# EAGLE design CCM_0020_receiver (EAGLE 9.3.2)

## Sheet 1 of 2: receiver
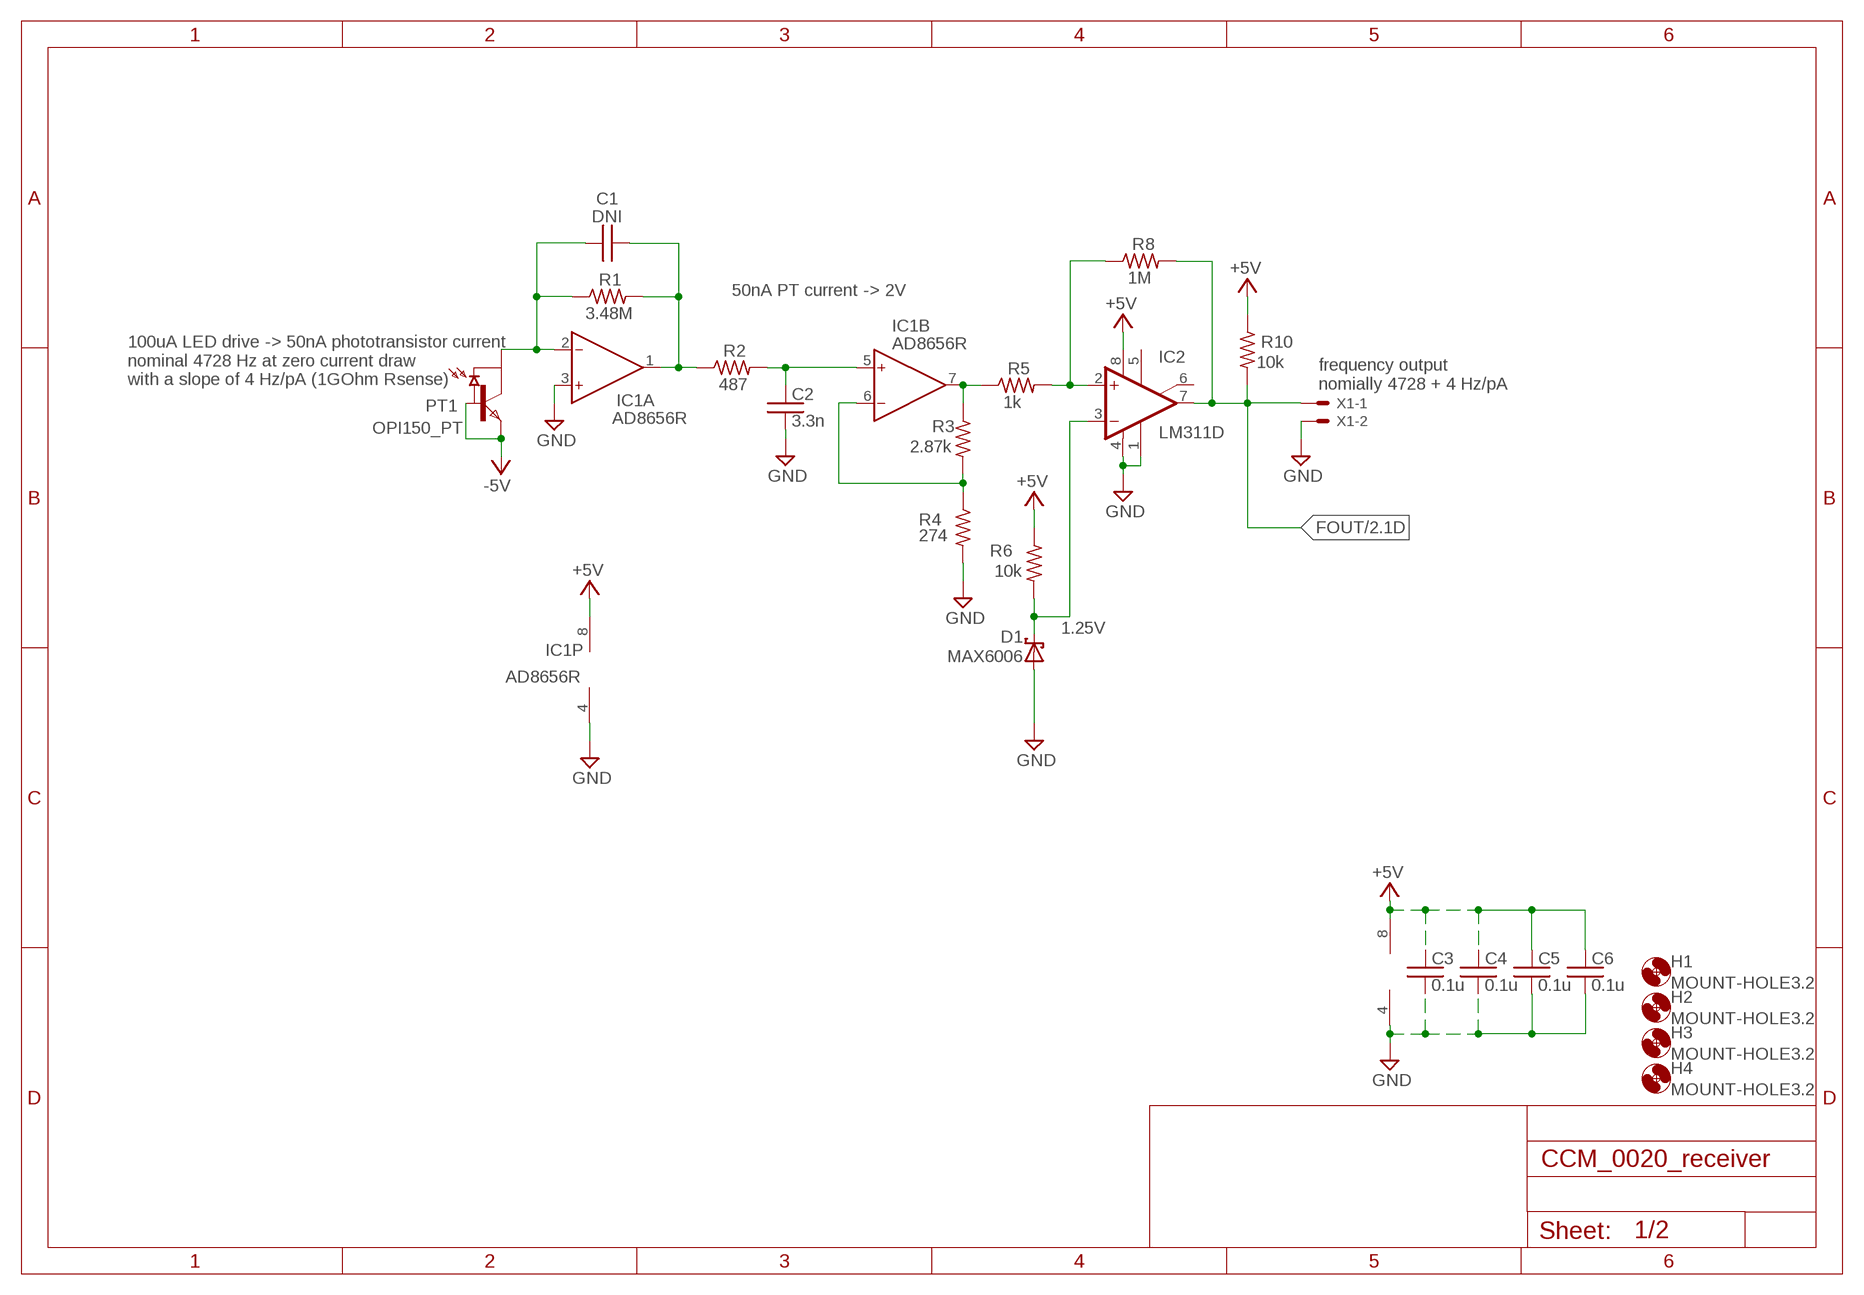
[diagram p0: schematic, sheet 1]

### Parts
C1  DNI  C0603  [0603]
C2  3.3n  C0603  [0603]
C3  0.1u  C0603  [0603]
C4  0.1u  C0603  [0603]
C5  0.1u  C0603  [0603]
C6  0.1u  C0603  [0603]
D1  MAX6006  LM4040  [SOT23]
H1  MOUNT-HOLE3.2  [3,2]
H2  MOUNT-HOLE3.2  [3,2]
H3  MOUNT-HOLE3.2  [3,2]
H4  MOUNT-HOLE3.2  [3,2]
IC1  AD8656R  [SO8]
IC2  LM311D  [SO08]
IC3  LT1495  LM393D  [SO08]
PT1  OPI150_PT  OPI150_PHOTOTRANSISTOR  [OPI150_PHOTOTRANSISTOR]
R1  3.48M  R0603  [0603]
R2  487  R0603  [0603]
R3  2.87k  R0603  [0603]
R4  274  R0603  [0603]
R5  1k  R0603  [0603]
R6  10k  R0603  [0603]
R8  1M  R0603  [0603]
R10  10k  R0603  [0603]
X1  22-23-2021  [22-23-2021]

### Nets
+5V: C3.1 C4.1 C5.1 C6.1 IC1.8(P:V+) IC2.8(V+) IC3.8(P:V+) R6.1 R10.1 ; also sheet 2
-5V: PT1.P4(BASE) PT1.P5(EMITTER)
FOUT: IC2.7(OUT) R8.2 R10.2 X1.1 ; also sheet 2
GND: C2.2 C3.2 C4.2 C5.2 C6.2 D1.2(A) IC1.3(A:IN+) IC1.4(P:V-) IC2.1(GND) IC2.4(V-) IC3.4(P:V-) R4.2 X1.2 ; also sheet 2
N$2: C1.1 IC1.2(A:IN-) PT1.P3(COLLECTOR) R1.1
N$3: C2.1 IC1.5(B:IN+) R2.2
N$4: C1.2 IC1.1(A:OUT) R1.2 R2.1
N$5: IC1.6(B:IN-) R3.2 R4.1
N$6: IC1.7(B:OUT) R3.1 R5.1
N$8: IC2.2(+IN) R5.2 R8.1
N$14: D1.1(C) IC2.3(-IN) R6.2
Unconnected: IC2.5(ON) IC2.6(ON/STR) IC3.1(A:OUT) IC3.2(A:-IN) IC3.3(A:+IN) IC3.5(B:+IN) IC3.6(B:-IN) IC3.7(B:OUT)

### Notes on the sheet
- 50nA PT current -> 2V
- 100uA LED drive -> 50nA phototransistor current
  nominal 4728 Hz at zero current draw
  with a slope of 4 Hz/pA (1GOhm Rsense)
- frequency output
  nomially 4728 + 4 Hz/pA
- 1.25V

## Sheet 2 of 2: frequency to voltage
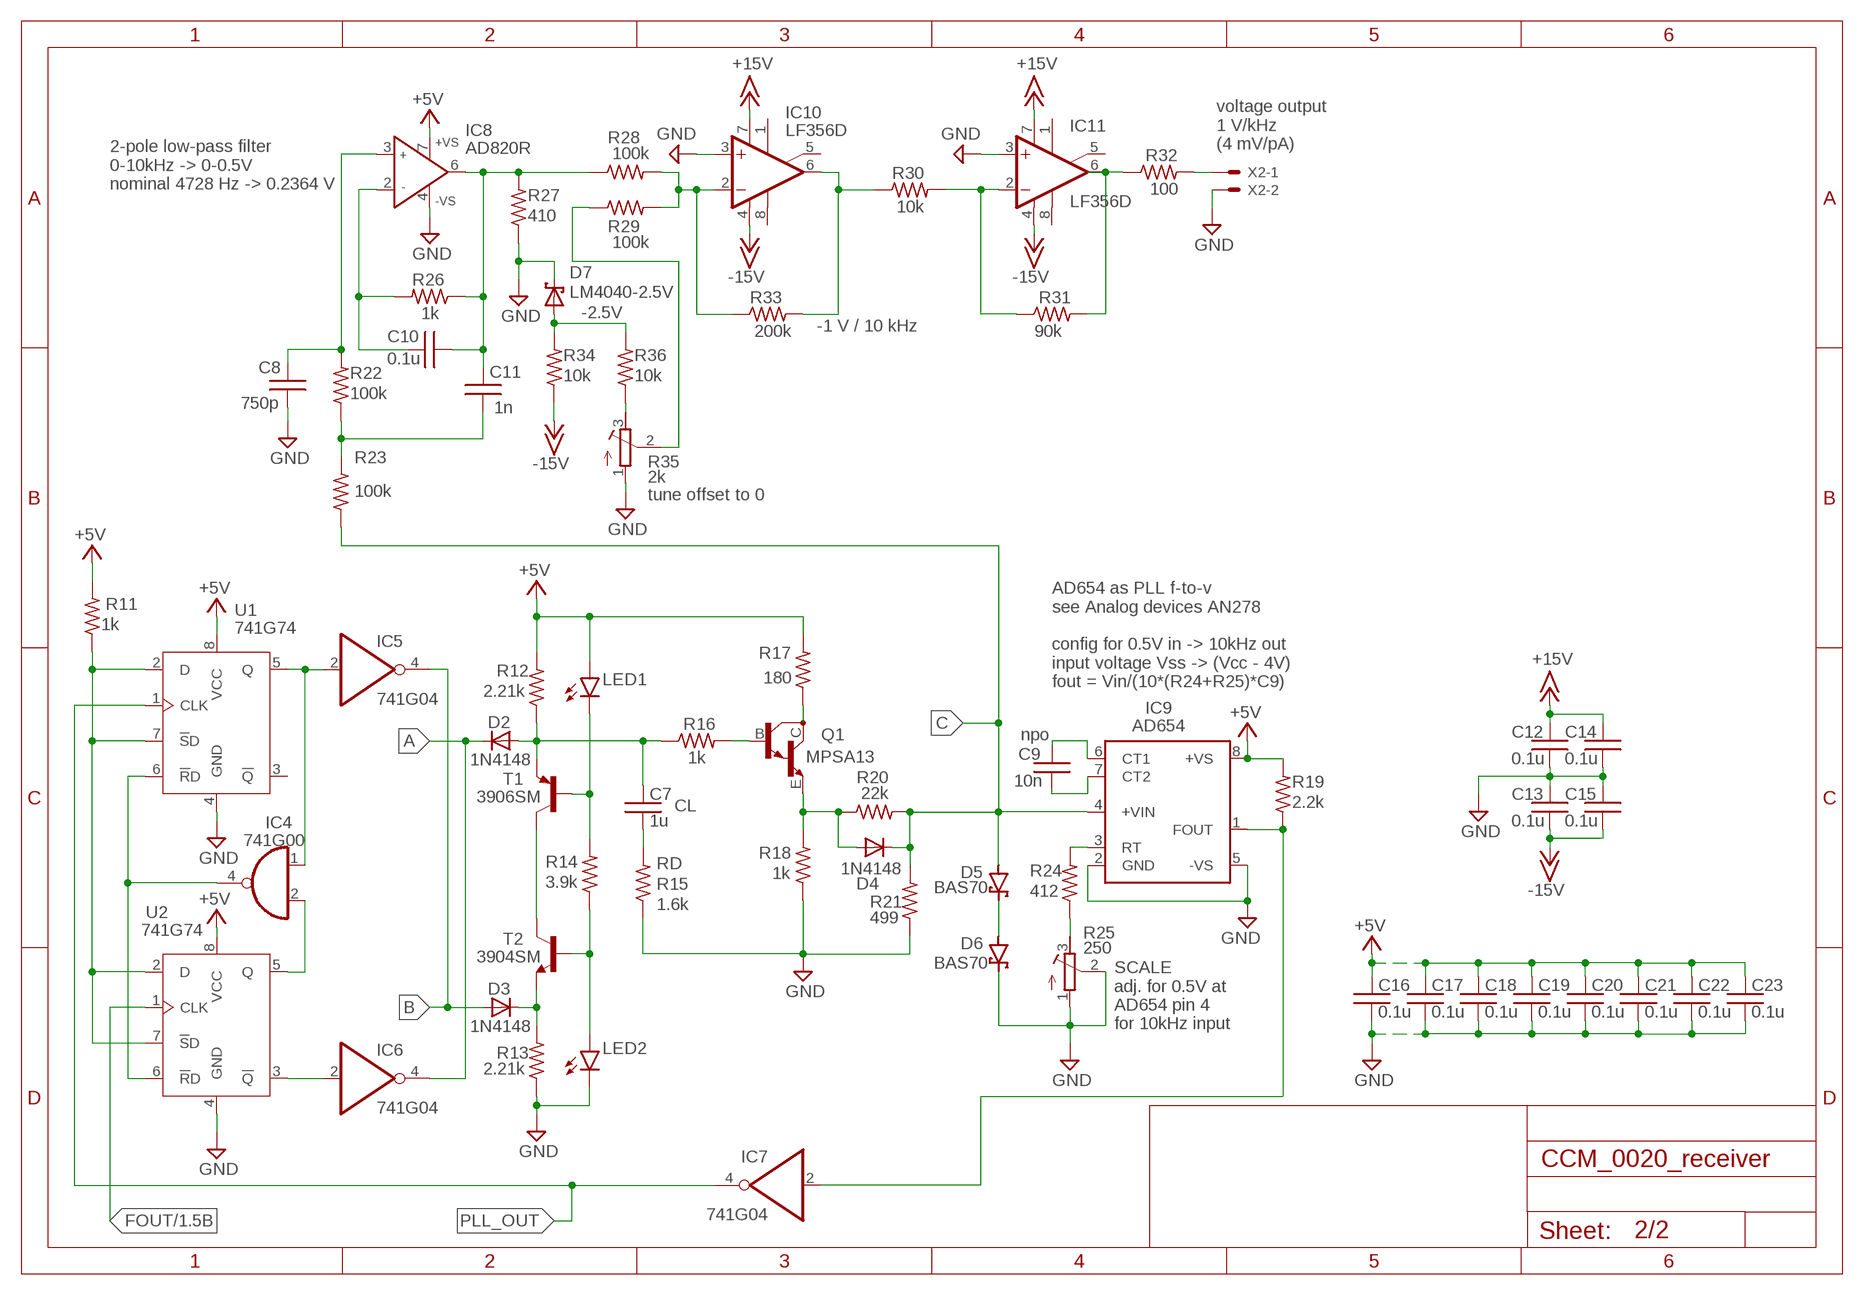
[diagram p1: schematic, sheet 2]

### Parts
C7  1u  C0603  [0603]
C8  750p  C0603  [0603]
C9  10n  C0603  [0603]
C10  0.1u  C0603  [0603]
C11  1n  C0603  [0603]
C12  0.1u  C0603  [0603]
C13  0.1u  C0603  [0603]
C14  0.1u  C0603  [0603]
C15  0.1u  C0603  [0603]
C16  0.1u  C0603  [0603]
C17  0.1u  C0603  [0603]
C18  0.1u  C0603  [0603]
C19  0.1u  C0603  [0603]
C20  0.1u  C0603  [0603]
C21  0.1u  C0603  [0603]
C22  0.1u  C0603  [0603]
C23  0.1u  C0603  [0603]
D2  1N4148  [SOD323_ST]
D3  1N4148  [SOD323_ST]
D4  1N4148  [SOD323_ST]
D5  BAS70  [SOT23]
D6  BAS70  [SOT23]
D7  LM4040-2.5V  LM4040  [SOT23]
IC4  741G00  74AHC1G00DBV  [SOT23-5]
IC5  741G04  74AHC1G04DBV  [SOT23-5]
IC6  741G04  74AHC1G04DBV  [SOT23-5]
IC7  741G04  74AHC1G04DBV  [SOT23-5]
IC8  AD820R  [SO8]
IC9  AD654  [SO08]
IC10  LF356D  [SO08]
IC11  LF356D  [SO08]
LED1  LEDCHIP-LED0603  [CHIP-LED0603]
LED2  LEDCHIP-LED0603  [CHIP-LED0603]
Q1  MPSA13  MMBTA13LT1  [SOT23-BEC]
R11  1k  R0603  [0603]
R12  2.21k  R0603  [0603]
R13  2.21k  R0603  [0603]
R14  3.9k  R0603  [0603]
R15  1.6k  R0603  [0603]
R16  1k  R0603  [0603]
R17  180  R0603  [0603]
R18  1k  R0603  [0603]
R19  2.2k  R0603  [0603]
R20  22k  R0603  [0603]
R21  499  R0603  [0603]
R22  100k  R0603  [0603]
R23  100k  R0603  [0603]
R24  412  R0603  [0603]
R25  250  R-TRIMM64Y  [RTRIM64Y]
R26  1k  R0603  [0603]
R27  410  R0603  [0603]
R28  100k  R0603  [0603]
R29  100k  R0603  [0603]
R30  10k  R0603  [0603]
R31  90k  R0603  [0603]
R32  100  R0603  [0603]
R33  200k  R0603  [0603]
R34  10k  R0603  [0603]
R35  2k  R-TRIMM64Y  [RTRIM64Y]
R36  10k  R0603  [0603]
T1  3906SM  MMBT3906LT1-PNP-SOT23-BEC  [SOT23-BEC]
T2  3904SM  [SOT23]
U1  741G74  [TSSOP8]
U2  741G74  [TSSOP8]
X2  22-23-2021  [22-23-2021]

### Nets
+5V: C16.1 C17.1 C18.1 C19.1 C20.1 C21.1 C22.1 C23.1 IC8.7(+VS) IC9.8(+VS) LED1.A R11.2 R12.2 R17.2 R19.2 U1.8(VCC) U2.8(VCC) ; also sheet 1
+15V: C12.2 C14.2 IC10.7(V+) IC11.7(V+)
-15V: C13.1 C15.1 IC10.4(V-) IC11.4(V-) R34.1
A: D2.C IC6.4(O)
B: D3.A IC5.4(O)
C: D4.C D5.1(A) IC9.4(+VIN) R20.2 R21.2 R23.1
FOUT: U2.1(CLK) ; also sheet 1
GND: C8.1 C12.1 C13.2 C14.1 C15.2 C16.2 C17.2 C18.2 C19.2 C20.2 C21.2 C22.2 C23.2 D6.3(C) D7.1(C) IC8.4(-VS) IC9.2(GND) IC9.5(-VS) IC10.3(+IN) IC11.3(+IN) LED2.C R13.1 R15.1 R18.1 R21.1 R25.1(A) R25.2(S) R27.1 R35.1(A) U1.4(GND) U2.4(GND) X2.2 ; also sheet 1
N$1: C9.1 IC9.6(CT1)
N$7: IC4.4(O) U1.6(!R!D) U2.6(!R!D)
N$10: IC4.2(I1) U2.5(Q)
N$11: R11.1 U1.2(D) U1.7(!S!D) U2.2(D) U2.7(!S!D)
N$12: IC6.2(I) U2.3(!Q)
N$13: C11.1 R22.1 R23.2
N$15: IC4.1(I0) IC5.2(I) U1.5(Q)
N$16: C8.2 IC8.3(IN+) R22.2
N$17: C9.2 IC9.7(CT2)
N$18: R24.1 R25.3(E)
N$19: D5.3(C) D6.1(A)
N$20: C7.1 D2.A R12.1 R16.1 T1.E
N$21: D3.C R13.2 T2.2(E)
N$22: T1.C T2.3(C)
N$23: LED1.C R14.2 T1.B
N$24: LED2.A R14.1 T2.1(B)
N$25: C7.2 R15.2
N$26: Q1.C R17.1
N$27: Q1.B R16.2
N$28: D4.A Q1.E R18.2 R20.1
N$29: IC9.3(RT) R24.2
N$30: IC7.2(I) IC9.1(FOUT) R19.1
N$31: C10.2 C11.2 IC8.6(OUT) R26.1 R27.2 R28.1
N$32: C10.1 IC8.2(IN-) R26.2
N$33: IC10.2(-IN) R28.2 R29.2 R33.1
N$34: IC11.6(OUT) R31.2 R32.1
N$35: IC11.2(-IN) R30.2 R31.1
N$36: R32.2 X2.1
N$37: IC10.6(OUT) R30.1 R33.2
N$38: D7.2(A) R34.2 R36.2
N$39: R29.1 R35.2(S)
N$40: R35.3(E) R36.1
PLL_OUT: IC7.4(O) U1.1(CLK)
Unconnected: IC10.1(ON1) IC10.5(ON2) IC10.8(OPT) IC11.1(ON1) IC11.5(ON2) IC11.8(OPT) U1.3(!Q)

### Notes on the sheet
- voltage output
  1 V/kHz
  (4 mV/pA)
- 2-pole low-pass filter
  0-10kHz -> 0-0.5V
  nominal 4728 Hz -> 0.2364 V
- -2.5V
- -1 V / 10 kHz
- tune offset to 0
- AD654 as PLL f-to-v
  see Analog devices AN278
  
  config for 0.5V in -> 10kHz out
  input voltage Vss -> (Vcc - 4V)
  fout = Vin/(10*(R24+R25)*C9)
- npo
- CL
- RD
- SCALE
  adj. for 0.5V at 
  AD654 pin 4
  for 10kHz input

## Power pins joined to a net without a drawn wire
GND: IC4.3(GND) IC5.3(GND) IC6.3(GND) IC7.3(GND)
VCC: IC4.5(VCC) IC5.5(VCC) IC6.5(VCC) IC7.5(VCC)

## Library data of the parts
C1-C23 = acrooptics:C: Capacitor
D1 D7 = noah:LM4040: LM4040 Reference Zener Diode
D2-D4 = custom_parts:1N4148: DIODE high speed (Philips)
D5 D6 = diode:BAS70: Silicon Schottky Diodes General-purpose diode for high-speed switching
H1-H4 = holes:MOUNT-HOLE: MOUNTING HOLE with drill center marker
IC1 = analog-devices:AD8656: Low Noise, Precision CMOS Amplifier Source: http://www.analog.com/static/imported-files/data_sheets/AD8655_8656.pdf; MPN: AD8656ARZ; OC_FARNELL: 1117887; OC_NEWARK: 19M0993
IC2 = linear:LM311: COMPARATOR
IC3 = linear:LM393: COMPARATOR
IC4 = 74xx-little-de:74*1G00: 2-input NAND gate
IC5-IC7 = 74xx-little-de:74*1G04: INVERTER Gate
IC8 = analog-devices:AD820: Single-Supply, Rail-to-Rail, Low Power, FET Input Op Amp Source: http://www.analog.com/static/imported-files/data_sheets/AD820.pdf; OC_FARNELL: 1838867; OC_NEWARK: unknown
IC9 = noah:AD654: Low Cost Monolithic Voltage-to-Frequency Converter
IC10 IC11 = linear:LF356: OP AMP
LED1 LED2 = led:LED: LED OSRAM: - CHIPLED LG R971, LG N971, LY N971, LG Q971, LY Q971, LO R971, LY R971 LH N974, LH R974 LS Q976, LO Q976, LY Q976 LO Q996 - Hyper CHIPLED LW Q18S LB Q993, LB Q99A, LB R99A - SideLED LS A670, LO A670, LY A670, LG A670, LP A670 LB A673, LV A673, LT A673, LW A673 LH A674 LY A675 LS A676, LA A676, LO A676, LY A676, LW A676 LS A679, LY A679, LG A679 - Hyper Micro SIDELED® LS Y876, LA Y876, LO Y876, LY Y876 LT Y87S - SmartLED LW L88C, LW L88S LB L89C, LB L89S, LG L890 LS L89K, LO L89K, LY L89K LS L896, LA L896, LO L896, LY L896 - TOPLED LS T670, LO T670, LY T670, LG T670, LP T670 LSG T670, LSP T670, LSY T670, LOP T670, LYG T670 LG T671, LOG T671, LSG T671 LB T673, LV T673, LT T673, LW T673 LH T674 LS T676, LA T676, LO T676, LY T676, LB T676, LH T676, LSB T676, LW T676 LB T67C, LV T67C, LT T67C, LS T67K, LO T67K, LY T67K, LW E67C LS E67B, LA E67B, LO E67B, LY E67B, LB E67C, LV E67C, LT E67C LW T67C LS T679, LY T679, LG T679 LS T770, LO T770, LY T770, LG T770, LP T770 LB T773, LV T773, LT T773, LW T773 LH T774 LS E675, LA E675, LY E675, LS T675 LS T776, LA T776, LO T776, LY T776, LB T776 LHGB T686 LT T68C, LB T68C - Hyper Mini TOPLED® LB M676 - Mini TOPLED Santana® LG M470 LS M47K, LO M47K, LY M47K Source: http://www.osram.convergy.de LUXEON: - LUMILED® LXK2-PW12-R00, LXK2-PW12-S00, LXK2-PW14-U00, LXK2-PW14-V00 LXK2-PM12-R00, LXK2-PM12-S00, LXK2-PM14-U00 LXK2-PE12-Q00, LXK2-PE12-R00, LXK2-PE12-S00, LXK2-PE14-T00, LXK2-PE14-U00 LXK2-PB12-K00, LXK2-PB12-L00, LXK2-PB12-M00, LXK2-PB14-N00, LXK2-PB14-P00, LXK2-PB14-Q00 LXK2-PR12-L00, LXK2-PR12-M00, LXK2-PR14-Q00, LXK2-PR14-R00 LXK2-PD12-Q00, LXK2-PD12-R00, LXK2-PD12-S00 LXK2-PH12-R00, LXK2-PH12-S00 LXK2-PL12-P00, LXK2-PL12-Q00, LXK2-PL12-R00 Source: www.luxeon.com KINGBRIGHT: KA-3528ASYC Source: www.kingbright.com
PT1 = noah:OPI150_PHOTOTRANSISTOR
Q1 = transistor-npn:MMBTA13*: NPN Darlington Transistor
R1-R6 R8 R10-R24 R26-R34 R36 = acrooptics:R: 0603 resistor
R25 R35 = rcl:R-TRIMM: Trimm resistor; SPICEMODEL: X; SPICEPREFIXL: POT
T1 = transistor:*-PNP-: PNP Transistror
T2 = noah:3904: NPN TRANSISTOR
U1 U2 = noah:74*1G74
X1 X2 = con-molex:22-23-2021: .100" (2.54mm) Center Header - 2 Pin; MF: MOLEX; MPN: 22-23-2021; OC_FARNELL: 1462926; OC_NEWARK: 25C3832

## Net classes
1 standard: width 0.61 mm, clearance 0.254 mm

## Board
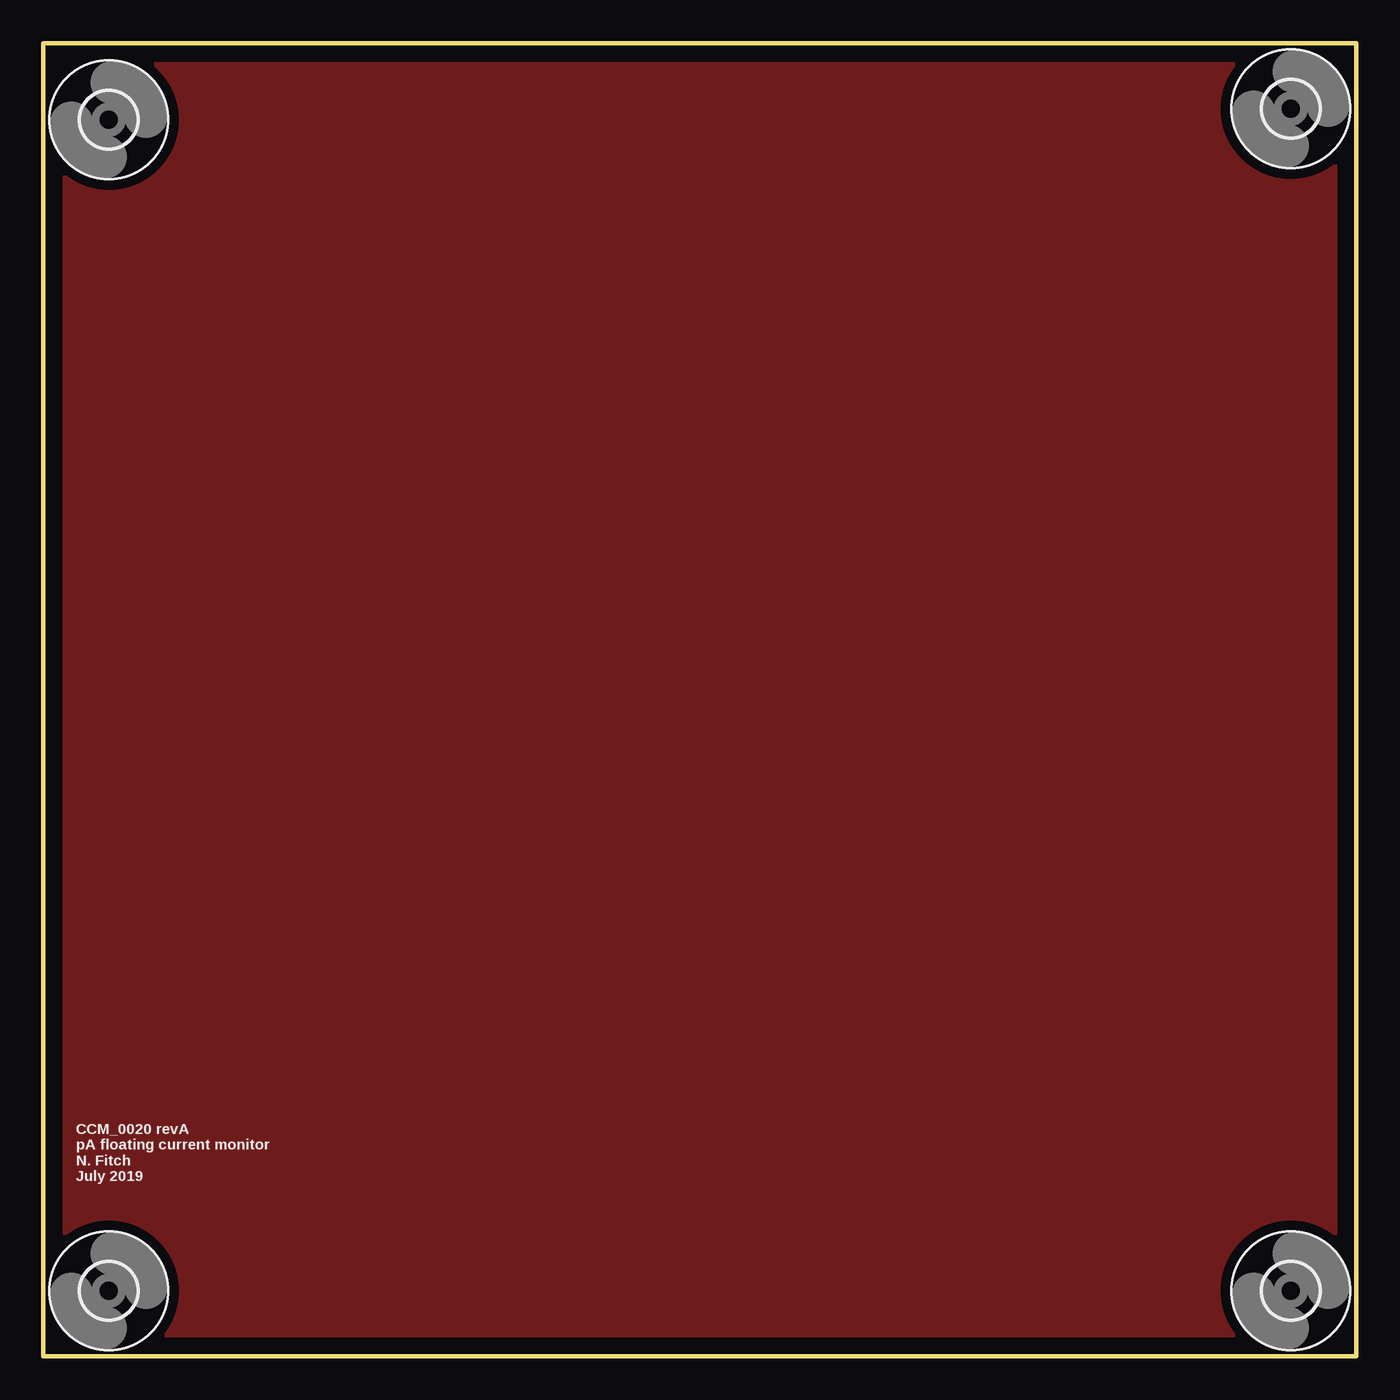
[diagram p2: board, top side]
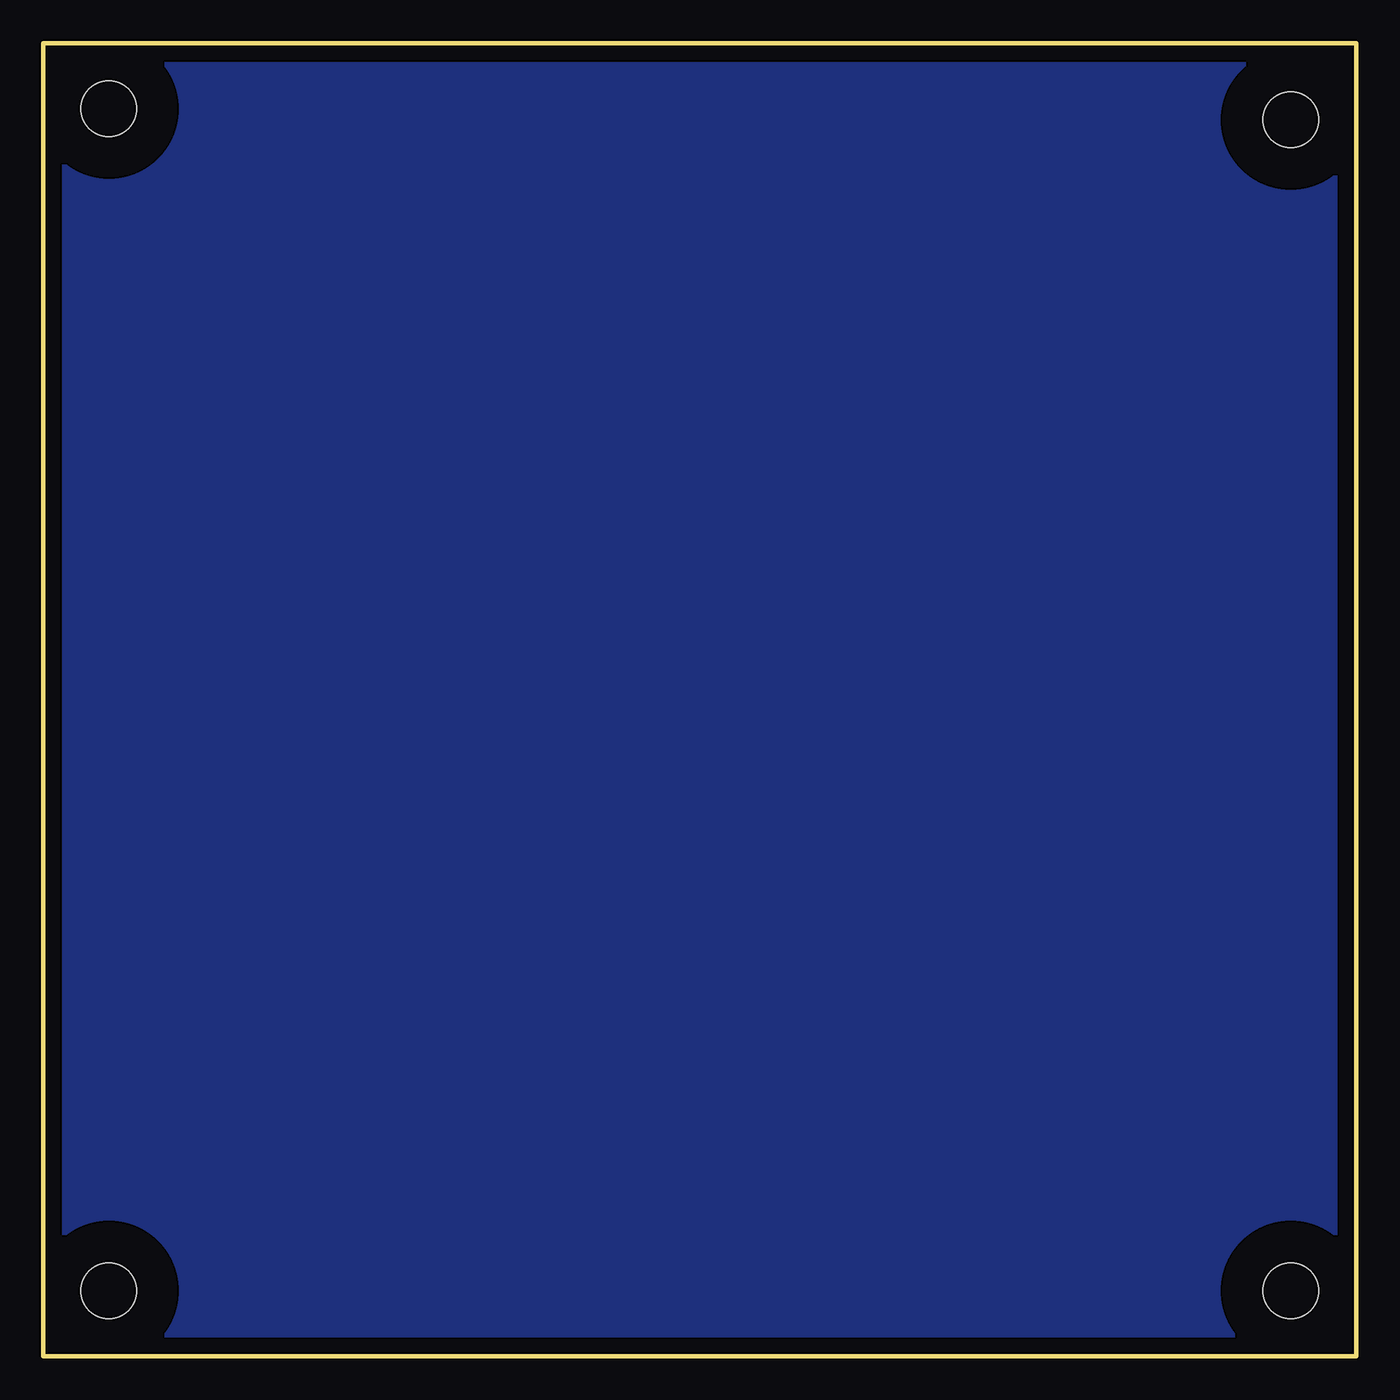
[diagram p3: board, bottom side, seen from below]

Size 76.2 x 76.2 mm. Coordinates in mm from the lower left corner, seen from the top.
Outline: 0,0 76.2,0 76.2,76.2 0,76.2 0,0
Copper layers (1*16): Top 0.035mm / dielectric 1.5mm / Bottom 0.035mm
Design rules "default *": minimum track width 10mil, minimum drill 10mil, track to track 7mil, track to pad 7mil, pad to pad 7mil, via to via 7mil, smd to smd 7mil, copper to edge 10mil, drill to drill 8mil, minimum pad ring 10mil, minimum via ring 8mil, stop-mask expansion 4mil, vias tented up to drill 0mil, thermal gap 10mil

### Footprints (pad centres in the part's own frame; a part is rotated, then mirrored left to right if it is on the bottom)
0603 = smd 1.016 x 1.016: 1 -0.889,0; 2 0.889,0
SOT23 = smd 1 x 1.4: 1 -0.95,-1.1; 2 0.95,-1.1; 3 0,1.1
SOD323_ST = smd 0.8 x 0.6: A 1.25,0; C -1.25,0
3,2 = hole 3.2: 0,0
SO8 = smd 0.6 x 2.2: 1 -1.905,-2.6; 2 -0.635,-2.6; 3 0.635,-2.6; 4 1.905,-2.6; 5 1.905,2.6; 6 0.635,2.6; 7 -0.635,2.6; 8 -1.905,2.6
SO08 = smd 0.6 x 2.2: 1 -1.905,-2.6; 2 -0.635,-2.6; 3 0.635,-2.6; 4 1.905,-2.6; 5 1.905,2.6; 6 0.635,2.6; 7 -0.635,2.6; 8 -1.905,2.6
SOT23-5 = smd 0.69 x 0.99: 1 -0.95,-1.29; 2 0,-1.29; 3 0.95,-1.29; 4 0.95,1.3; 5 -0.95,1.3
SO08' = smd 0.61 x 2.21: 1 -1.905,-2.616; 2 -0.635,-2.616; 3 0.635,-2.616; 4 1.905,-2.616; 5 1.905,2.616; 6 0.635,2.616; 7 -0.635,2.616; 8 -1.905,2.616
CHIP-LED0603 = smd 0.8 x 0.8: A 0,-0.75; C 0,0.75
OPI150_PHOTOTRANSISTOR = drill 0.6: P3 0,1.27; P4 1.27,0; P5 0,-1.27
SOT23-BEC = smd 1 x 1.4: B -0.95,-1.1; C 0,1.1; E 0.95,-1.1
RTRIM64Y = drill 0.61: 1 0,-2.54; 2 -2.54,0; 3 0,2.54
TSSOP8 = smd 0.9 x 0.35: 1 -2.875,0.975; 2 -2.875,0.325; 3 -2.875,-0.325; 4 -2.875,-0.975; 5 2.875,-0.975; 6 2.875,-0.325; 7 2.875,0.325; 8 2.875,0.975
22-23-2021 = drill 1 long: 1 -1.27,0; 2 1.27,0

### Placement (x,y rotation side)
C1  -317.5,-451.49 0 top  (outside the outline)
C2  -326.39,-451.49 0 top  (outside the outline)
C3  -227.71,-194.44 0 top  (outside the outline)
C4  -231.97,-194.44 0 top  (outside the outline)
C5  -267.08,-319.21 0 top  (outside the outline)
C6  -271.34,-319.21 0 top  (outside the outline)
C7  -485.77,-540.38 0 top  (outside the outline)
C8  -525.78,-546.1 0 top  (outside the outline)
C9  -388.62,-464.19 0 top  (outside the outline)
C10  -512.45,-546.1 0 top  (outside the outline)
C11  -516.89,-546.1 0 top  (outside the outline)
C12  -609.6,-582.29 0 top  (outside the outline)
C13  -614.04,-582.29 0 top  (outside the outline)
C14  -614.04,-587.38 0 top  (outside the outline)
C15  -614.04,-591.82 0 top  (outside the outline)
C16  -614.04,-596.26 0 top  (outside the outline)
C17  -609.6,-596.26 0 top  (outside the outline)
C18  -614.04,-600.71 0 top  (outside the outline)
C19  -609.6,-600.71 0 top  (outside the outline)
C20  -614.04,-605.15 0 top  (outside the outline)
C21  -614.04,-609.6 0 top  (outside the outline)
C22  -614.04,-614.04 0 top  (outside the outline)
C23  -614.04,-618.49 0 top  (outside the outline)
D1  -368.3,-457.83 0 top  (outside the outline)
D2  -444.5,-534.67 0 top  (outside the outline)
D3  -444.5,-540.38 0 top  (outside the outline)
D4  -490.22,-546.1 0 top  (outside the outline)
D5  -434.98,-520.7 0 top  (outside the outline)
D6  -434.98,-528.32 0 top  (outside the outline)
D7  -586.74,-581.02 0 top  (outside the outline)
H1  3.81,3.81 0 top
H2  72.39,3.81 0 top
H3  3.81,71.75 0 top
H4  72.39,72.39 0 top
IC1  -295.91,-450.21 0 top  (outside the outline)
IC2  -296.55,-440.06 0 top  (outside the outline)
IC3  -221.23,-192.91 0 top  (outside the outline)
IC4  -401.32,-490.86 0 top  (outside the outline)
IC5  -409.57,-490.86 0 top  (outside the outline)
IC6  -417.83,-490.86 0 top  (outside the outline)
IC7  -426.08,-490.86 0 top  (outside the outline)
IC8  -532.13,-554.36 0 top  (outside the outline)
IC9  AD654  [SO08']  -386.71,-457.2 0 top  (outside the outline)
IC10  -570.87,-572.77 0 top  (outside the outline)
IC11  -580.39,-572.77 0 top  (outside the outline)
LED1  -471.81,-541.02 0 top  (outside the outline)
LED2  -476.88,-541.02 0 top  (outside the outline)
PT1  -287.65,-440.06 0 top  (outside the outline)
Q1  -426.72,-513.08 0 top  (outside the outline)
R1  -313.06,-451.49 0 top  (outside the outline)
R2  -321.94,-451.49 0 top  (outside the outline)
R3  -330.83,-451.49 0 top  (outside the outline)
R4  -335.28,-451.49 0 top  (outside the outline)
R5  -351.15,-451.49 0 top  (outside the outline)
R6  -373.38,-459.11 0 top  (outside the outline)
R8  -355.6,-451.49 0 top  (outside the outline)
R10  -360.05,-451.49 0 top  (outside the outline)
R11  -393.7,-493.39 0 top  (outside the outline)
R12  -448.94,-540.38 0 top  (outside the outline)
R13  -462.28,-540.38 0 top  (outside the outline)
R14  -466.73,-540.38 0 top  (outside the outline)
R15  -481.33,-540.38 0 top  (outside the outline)
R16  -453.39,-540.38 0 top  (outside the outline)
R17  -457.83,-540.38 0 top  (outside the outline)
R18  -388.62,-468.63 0 top  (outside the outline)
R19  -431.17,-514.35 0 top  (outside the outline)
R20  -490.22,-540.38 0 top  (outside the outline)
R21  -494.67,-546.1 0 top  (outside the outline)
R22  -503.56,-546.1 0 top  (outside the outline)
R23  -499.11,-546.1 0 top  (outside the outline)
R24  -435.61,-514.35 0 top  (outside the outline)
R25  -441.32,-526.41 0 top  (outside the outline)
R26  -508,-546.1 0 top  (outside the outline)
R27  -521.34,-546.1 0 top  (outside the outline)
R28  -546.1,-565.15 0 top  (outside the outline)
R29  -550.54,-565.15 0 top  (outside the outline)
R30  -554.99,-574.67 0 top  (outside the outline)
R31  -559.43,-574.67 0 top  (outside the outline)
R32  -563.88,-574.67 0 top  (outside the outline)
R33  -587.38,-574.67 0 top  (outside the outline)
R34  -591.82,-582.29 0 top  (outside the outline)
R35  -597.53,-579.12 0 top  (outside the outline)
R36  -605.15,-582.29 0 top  (outside the outline)
T1  -426.72,-507.37 0 top  (outside the outline)
T2  -426.72,-499.75 0 top  (outside the outline)
U1  -387.35,-484.5 0 top  (outside the outline)
U2  -387.35,-492.12 0 top  (outside the outline)
X1  -379.1,-455.93 0 top  (outside the outline)
X2  -541.02,-552.45 0 top  (outside the outline)

### Tracks (layer width: path | path; a pad name or v marks a point on that pad's centre or on a via)
+5V  (25 unrouted)
  pour Top: 1.27,1.27 1.27,74.93 74.93,74.93 74.93,1.27
+15V  (3 unrouted)
-5V  (1 unrouted)
-15V  (4 unrouted)
A  (1 unrouted)
B  (1 unrouted)
C  (5 unrouted)
FOUT  (4 unrouted)
GND  (48 unrouted)
  pour Bottom: 1.27,1.27 1.27,74.93 74.93,74.93 74.93,1.27
N$1  (1 unrouted)
N$2  (3 unrouted)
N$3  (2 unrouted)
N$4  (3 unrouted)
N$5  (2 unrouted)
N$6  (2 unrouted)
N$7  (2 unrouted)
N$8  (2 unrouted)
N$10  (1 unrouted)
N$11  (4 unrouted)
N$12  (1 unrouted)
N$13  (2 unrouted)
N$14  (2 unrouted)
N$15  (2 unrouted)
N$16  (2 unrouted)
N$17  (1 unrouted)
N$18  (1 unrouted)
N$19  (1 unrouted)
N$20  (4 unrouted)
N$21  (2 unrouted)
N$22  (1 unrouted)
N$23  (2 unrouted)
N$24  (2 unrouted)
N$25  (1 unrouted)
N$26  (1 unrouted)
N$27  (1 unrouted)
N$28  (3 unrouted)
N$29  (1 unrouted)
N$30  (2 unrouted)
N$31  (5 unrouted)
N$32  (2 unrouted)
N$33  (3 unrouted)
N$34  (2 unrouted)
N$35  (2 unrouted)
N$36  (1 unrouted)
N$37  (2 unrouted)
N$38  (2 unrouted)
N$39  (1 unrouted)
N$40  (1 unrouted)
PLL_OUT  (1 unrouted)
VCC  (3 unrouted)

### Text on the board
tPlace: CCM_0020 revA / pA floating current monitor / N. Fitch / July 2019